# Altium schematic sheet 01_ESP-CAM.SchDoc: ESP-EYE
size 840 x 594 mm; Page Create Date: March  8, 1995; Page Number: 1; Page Size: A1; Page Count: 1; RevCode: 2.1; DsnPath: D:\GH0050\prj\pcb\Others\esp32\CAM3\ESP-CAM_V28.DSN; SchematicName: SCHEMATIC1; PageName: 01_ESP-CAM; PageSize: A1; TopSchematic: True
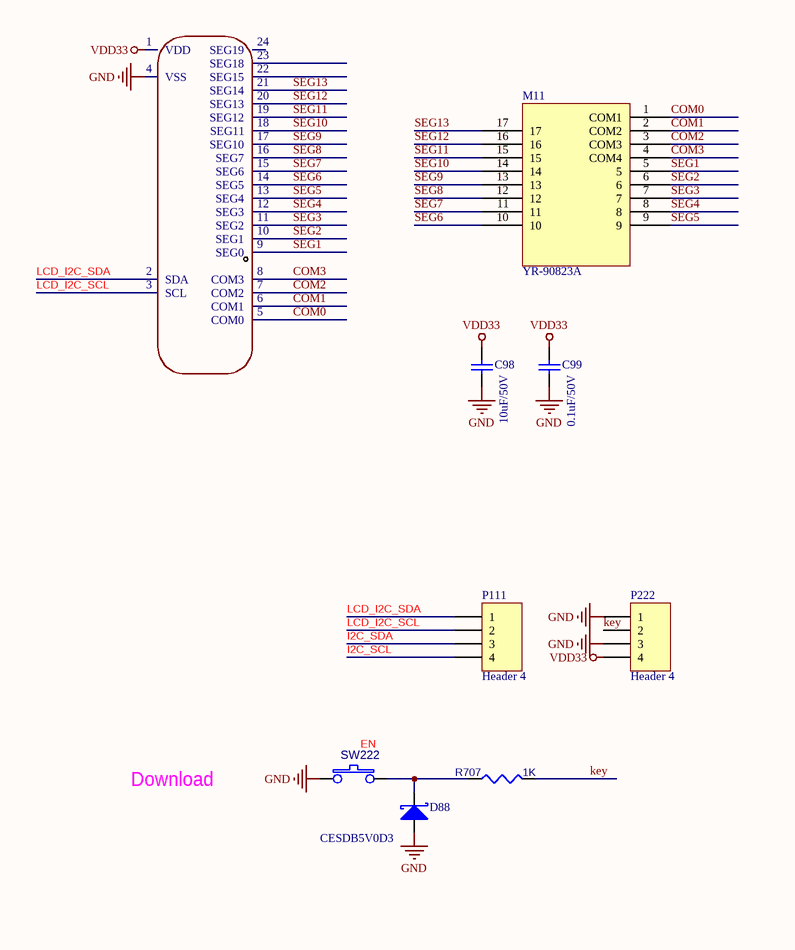
[diagram p0: 01_ESP-CAM.SchDoc, top left]
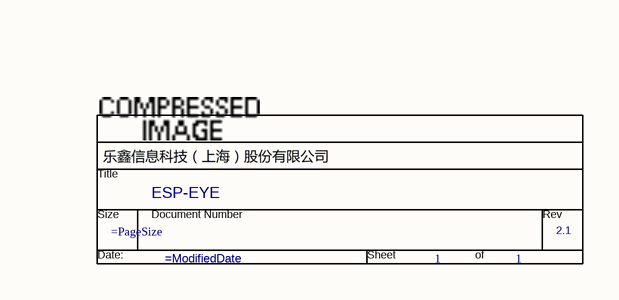
[diagram p1: 01_ESP-CAM.SchDoc, bottom right]

## Parts
*  RevCode: 2.1  Title: ESP-EYE  Page Number: 1  (graphical)
C98  10uF/50V  [0805C]
C99  0.1uF/50V  [0603C]
D88  CESDB5V0D3  [SOD323]
M11  YR-90823A  [YR-90823A]
P111  Header 4  [1.27-4P]
P222  Header 4  [1.27-4P]
R707  value 1K  [0402R]  (hidden comment: RESISTOR_0)
SW222  SW PUSHBUTTON  [SW-SMD_L3.9-W3.0-P4.45]  (value not drawn)
U222  HT16C21A-24SOP  [SOP65P640X265-24N]  (value not drawn)

## Nets
GND: C98.1 C99.1 D88.1(A) P222.1 P222.3 SW222.1 U222.4(VSS)
VDD33: C98.2 C99.2 P222.4 U222.1(VDD)
COM0: M11.1(COM1) U222.5(COM0)
COM1: M11.2(COM2) U222.6(COM1)
COM2: M11.3(COM3) U222.7(COM2)
COM3: M11.4(COM4) U222.8(COM3)
I2C_SCL: P111.4
I2C_SDA: P111.3
key: P222.2 R707.2
LCD_I2C_SCL: P111.2 U222.3(SCL)
LCD_I2C_SDA: P111.1 U222.2(SDA)
SEG1: M11.5 U222.9(SEG0)
SEG2: M11.6 U222.10(SEG1)
SEG3: M11.7 U222.11(SEG2)
SEG4: M11.8 U222.12(SEG3)
SEG5: M11.9 U222.13(SEG4)
SEG6: M11.10 U222.14(SEG5)
SEG7: M11.11 U222.15(SEG6)
SEG8: M11.12 U222.16(SEG7)
SEG9: M11.13 U222.17(SEG10)
SEG10: M11.14 U222.18(SEG11)
SEG11: M11.15 U222.19(SEG12)
SEG12: M11.16 U222.20(SEG13)
SEG13: M11.17 U222.21(SEG14)
NetD88_2: D88.2(K) R707.1 SW222.2

Not connected (* = marked no-connect by the designer): U222 22(SEG15) 23(SEG18) 24(SEG19)

## Notes on the sheet
- Download
- Labels drawn without touching a wire or pin: EN
- (in symbol espTitleBlock1) Title; Size; Document Number; Rev; Date:; Sheet; of

## Library data of the parts
* = espTitleBlock1: Page Create Date: March  8, 1995; Page Size: =PageSize; Page Count: 1; Page Modify Date: =ModifiedDate
C98 C99 = Cap: Capacitor; Value: 22nF; Published: 8-Jun-2000; LatestRevisionDate: 17-Jul-2002; LatestRevisionNote: Re-released for DXP Platform.; PackageReference: RAD-0.3; Publisher: Altium Limited; PackageDescription: Radial Cap, Thru-Hole; 2 Leads; 0.3 in Pin Spacing
D88 = DIODE S: Schottky Diode
P111 P222 = Header 4: Header, 4-Pin; LatestRevisionDate: 17-Jul-2002; LatestRevisionNote: Re-released for DXP Platform.; Publisher: Altium Limited
R707 = RESISTOR_0: Part Reference: R70; SIGNAL_MODEL: DEFAULT_RESISTOR_200OHM_1_2; PCB Footprint: R0402
SW222 = SW PUSHBUTTON: Part Reference: SW2; PCB Footprint: KEY_3X6; Value: SW PUSHBUTTON
U222 = HT16C21A-24SOP: Symbol: HT1621BM/TR; Add into BOM: yes; Device: HT1621BM/TR; Supplier: LCSC; Supplier Part: C2987283; Manufacturer Part: HT1621BM/TR; JLCPCB Part Class: Extended Part; Supplier Footprint: SSOP-48-300mil; Datasheet: https://atta.szlcsc.com/upload/public/pdf/source/20210713/C512789_EAEA0A466E7F817181A87DC85DF4172E.pdf; Convert to PCB: yes